# EAGLE schematic E8-F (EAGLE 6.6.0)

## Sheet 1 of 2
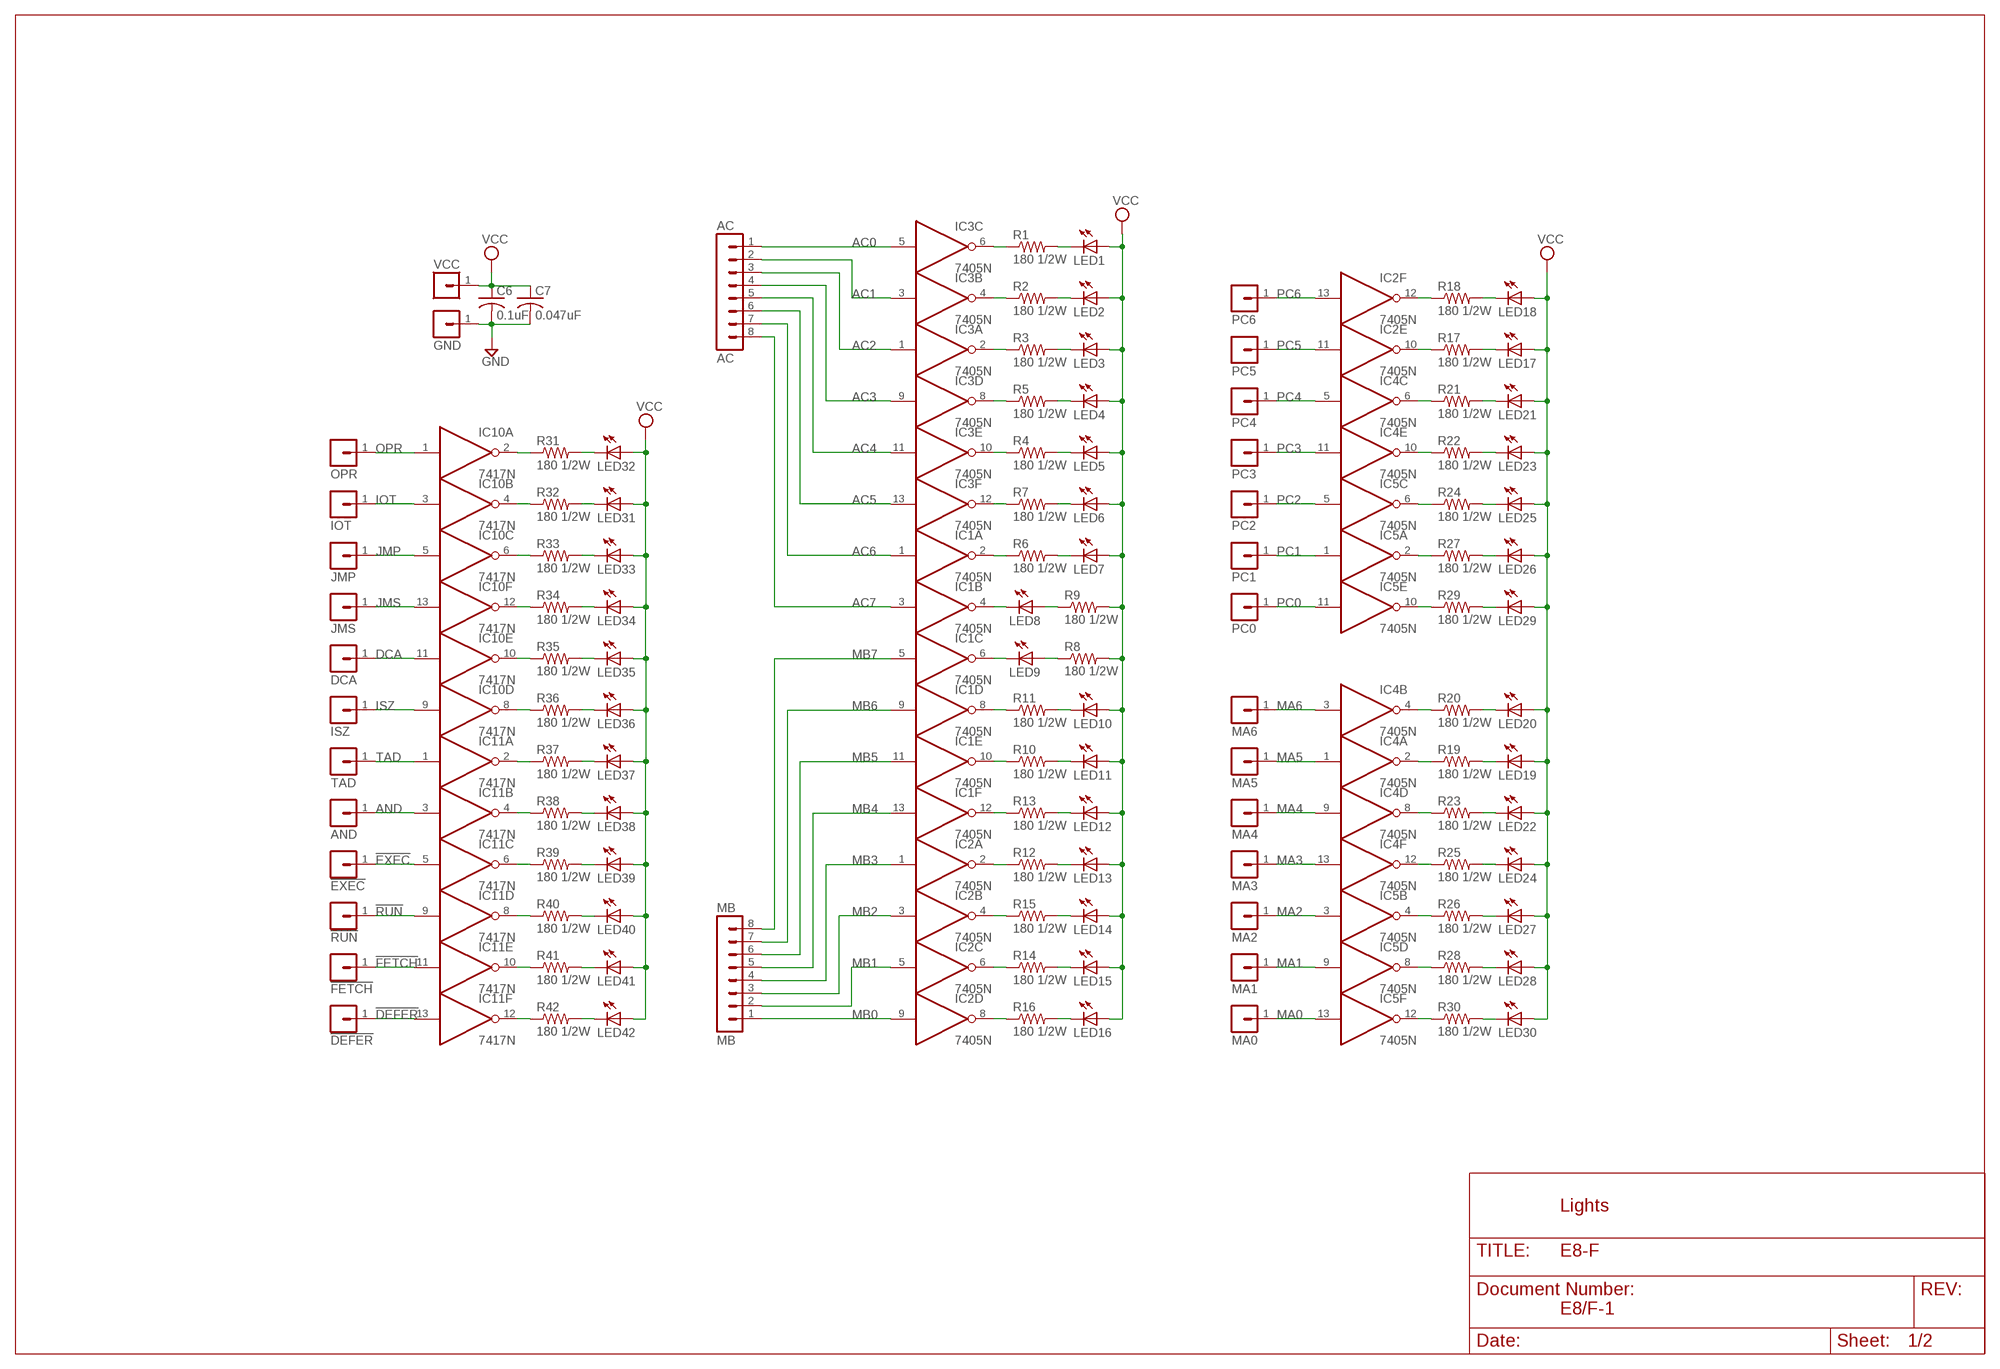
[diagram p0: schematic, sheet 1]

### Parts
!DEFER  MA01-1  [MA01-1]
!EXEC  MA01-1  [MA01-1]
!FETCH  MA01-1  [MA01-1]
!RUN  MA01-1  [MA01-1]
AC  AC  MA08-1  [MA08-1]
AND  MA01-1  [MA01-1]
C6  0.1uF  C-US075-032X103  [C075-032X103]
C7  0.047uF  C-US075-032X103  [C075-032X103]
DCA  MA01-1  [MA01-1]
GND  MA01-1  [MA01-1]
IC1  7405N  [DIL14]
IC2  7405N  [DIL14]
IC3  7405N  [DIL14]
IC4  7405N  [DIL14]
IC5  7405N  [DIL14]
IC10  7417N  [DIL14]
IC11  7417N  [DIL14]
IOT  MA01-1  [MA01-1]
ISZ  MA01-1  [MA01-1]
JMP  MA01-1  [MA01-1]
JMS  MA01-1  [MA01-1]
LED1  LED5MM  [LED5MM]
LED2  LED5MM  [LED5MM]
LED3  LED5MM  [LED5MM]
LED4  LED5MM  [LED5MM]
LED5  LED5MM  [LED5MM]
LED6  LED5MM  [LED5MM]
LED7  LED5MM  [LED5MM]
LED8  LED5MM  [LED5MM]
LED9  LED5MM  [LED5MM]
LED10  LED5MM  [LED5MM]
LED11  LED5MM  [LED5MM]
LED12  LED5MM  [LED5MM]
LED13  LED5MM  [LED5MM]
LED14  LED5MM  [LED5MM]
LED15  LED5MM  [LED5MM]
LED16  LED5MM  [LED5MM]
LED17  LED5MM  [LED5MM]
LED18  LED5MM  [LED5MM]
LED19  LED5MM  [LED5MM]
LED20  LED5MM  [LED5MM]
LED21  LED5MM  [LED5MM]
LED22  LED5MM  [LED5MM]
LED23  LED5MM  [LED5MM]
LED24  LED5MM  [LED5MM]
LED25  LED5MM  [LED5MM]
LED26  LED5MM  [LED5MM]
LED27  LED5MM  [LED5MM]
LED28  LED5MM  [LED5MM]
LED29  LED5MM  [LED5MM]
LED30  LED5MM  [LED5MM]
LED31  LED5MM  [LED5MM]
LED32  LED5MM  [LED5MM]
LED33  LED5MM  [LED5MM]
LED34  LED5MM  [LED5MM]
LED35  LED5MM  [LED5MM]
LED36  LED5MM  [LED5MM]
LED37  LED5MM  [LED5MM]
LED38  LED5MM  [LED5MM]
LED39  LED5MM  [LED5MM]
LED40  LED5MM  [LED5MM]
LED41  LED5MM  [LED5MM]
LED42  LED5MM  [LED5MM]
MA0  MA01-1  [MA01-1]
MA1  MA01-1  [MA01-1]
MA2  MA01-1  [MA01-1]
MA3  MA01-1  [MA01-1]
MA4  MA01-1  [MA01-1]
MA5  MA01-1  [MA01-1]
MA6  MA01-1  [MA01-1]
MB  MB  MA08-1  [MA08-1]
OPR  MA01-1  [MA01-1]
PC0  MA01-1  [MA01-1]
PC1  MA01-1  [MA01-1]
PC2  MA01-1  [MA01-1]
PC3  MA01-1  [MA01-1]
PC4  MA01-1  [MA01-1]
PC5  MA01-1  [MA01-1]
PC6  MA01-1  [MA01-1]
R1  180 1/2W  R-US_0309/.45  [0309/.45]
R2  180 1/2W  R-US_0309/.45  [0309/.45]
R3  180 1/2W  R-US_0309/.45  [0309/.45]
R4  180 1/2W  R-US_0309/12  [0309/12]
R5  180 1/2W  R-US_0309/.45  [0309/.45]
R6  180 1/2W  R-US_0309/12  [0309/12]
R7  180 1/2W  R-US_0309/.45  [0309/.45]
R8  180 1/2W  R-US_0309/12  [0309/12]
R9  180 1/2W  R-US_0309/12  [0309/12]
R10  180 1/2W  R-US_0309/.45  [0309/.45]
R11  180 1/2W  R-US_0309/11  [0309/11]
R12  180 1/2W  R-US_0309/12  [0309/12]
R13  180 1/2W  R-US_0309/.45  [0309/.45]
R14  180 1/2W  R-US_0309/.45  [0309/.45]
R15  180 1/2W  R-US_0309/12  [0309/12]
R16  180 1/2W  R-US_0309/12  [0309/12]
R17  180 1/2W  R-US_0309/12  [0309/12]
R18  180 1/2W  R-US_0309/12  [0309/12]
R19  180 1/2W  R-US_0309/12  [0309/12]
R20  180 1/2W  R-US_0309/15  [0309/15]
R21  180 1/2W  R-US_0309/.45  [0309/.45]
R22  180 1/2W  R-US_0309/10  [0309/10]
R23  180 1/2W  R-US_0309/10  [0309/10]
R24  180 1/2W  R-US_0309/12  [0309/12]
R25  180 1/2W  R-US_0309/10  [0309/10]
R26  180 1/2W  R-US_0309/10  [0309/10]
R27  180 1/2W  R-US_0309/15  [0309/15]
R28  180 1/2W  R-US_0309/.45  [0309/.45]
R29  180 1/2W  R-US_0309/.45  [0309/.45]
R30  180 1/2W  R-US_0309/.45  [0309/.45]
R31  180 1/2W  R-US_0309/8  [0309/8]
R32  180 1/2W  R-US_0309/8  [0309/8]
R33  180 1/2W  R-US_0309/8  [0309/8]
R34  180 1/2W  R-US_0309/8  [0309/8]
R35  180 1/2W  R-US_0309/8  [0309/8]
R36  180 1/2W  R-US_0309/8  [0309/8]
R37  180 1/2W  R-US_0309/8  [0309/8]
R38  180 1/2W  R-US_0309/8  [0309/8]
R39  180 1/2W  R-US_0309/10  [0309/10]
R40  180 1/2W  R-US_0309/10  [0309/10]
R41  180 1/2W  R-US_0309/10  [0309/10]
R42  180 1/2W  R-US_0309/10  [0309/10]
TAD  MA01-1  [MA01-1]
VCC  MA01-1  [MA01-1]

### Nets
!DEFER: !DEFER.1 IC11.13(F:I)
!EXEC: !EXEC.1 IC11.5(C:I)
!FETCH: !FETCH.1 IC11.11(E:I)
!RUN: !RUN.1 IC11.9(D:I)
AC0: AC.1 IC3.5(C:I)
AC1: AC.2 IC3.3(B:I)
AC2: AC.3 IC3.1(A:I)
AC3: AC.4 IC3.9(D:I)
AC4: AC.5 IC3.11(E:I)
AC5: AC.6 IC3.13(F:I)
AC6: AC.7 IC1.1(A:I)
AC7: AC.8 IC1.3(B:I)
AND: AND.1 IC11.3(B:I)
DCA: DCA.1 IC10.11(E:I)
GND: C6.2 C7.2 GND.1 ; also sheet 2
IOT: IC10.3(B:I) IOT.1
ISZ: IC10.9(D:I) ISZ.1
JMP: IC10.5(C:I) JMP.1
JMS: IC10.13(F:I) JMS.1
MA0: IC5.13(F:I) MA0.1
MA1: IC5.9(D:I) MA1.1
MA2: IC5.3(B:I) MA2.1
MA3: IC4.13(F:I) MA3.1
MA4: IC4.9(D:I) MA4.1
MA5: IC4.1(A:I) MA5.1
MA6: IC4.3(B:I) MA6.1
MB0: IC2.9(D:I) MB.1
MB1: IC2.5(C:I) MB.2
MB2: IC2.3(B:I) MB.3
MB3: IC2.1(A:I) MB.4
MB4: IC1.13(F:I) MB.5
MB5: IC1.11(E:I) MB.6
MB6: IC1.9(D:I) MB.7
MB7: IC1.5(C:I) MB.8
N$1: IC2.12(F:O) R18.1
N$2: IC2.10(E:O) R17.1
N$3: IC3.6(C:O) R1.1
N$4: IC3.4(B:O) R2.1
N$5: IC3.2(A:O) R3.1
N$6: IC3.12(F:O) R7.1
N$7: LED7.K(C) R6.2
N$8: LED12.K(C) R13.2
N$9: IC1.10(E:O) R10.1
N$10: LED10.K(C) R11.2
N$11: IC1.6(C:O) LED9.K(C)
N$12: LED8.A R9.1
N$13: IC1.2(A:O) R6.1
N$14: LED9.A R8.1
N$15: IC1.4(B:O) LED8.K(C)
N$16: IC1.8(D:O) R11.1
N$17: LED11.K(C) R10.2
N$18: IC2.8(D:O) R16.1
N$19: LED13.K(C) R12.2
N$20: LED18.K(C) R18.2
N$21: LED17.K(C) R17.2
N$22: LED16.K(C) R16.2
N$23: LED15.K(C) R14.2
N$24: LED14.K(C) R15.2
N$25: IC2.6(C:O) R14.1
N$26: IC2.4(B:O) R15.1
N$27: IC2.2(A:O) R12.1
N$28: IC1.12(F:O) R13.1
N$29: IC3.10(E:O) R4.1
N$30: IC3.8(D:O) R5.1
N$31: LED1.K(C) R1.2
N$32: LED6.K(C) R7.2
N$33: LED5.K(C) R4.2
N$34: LED4.K(C) R5.2
N$35: LED3.K(C) R3.2
N$36: LED2.K(C) R2.2
N$37: LED25.K(C) R24.2
N$38: LED19.K(C) R19.2
N$39: LED24.K(C) R25.2
N$40: LED23.K(C) R22.2
N$41: LED22.K(C) R23.2
N$42: LED21.K(C) R21.2
N$43: IC5.6(C:O) R24.1
N$44: LED26.K(C) R27.2
N$45: LED27.K(C) R26.2
N$46: LED28.K(C) R28.2
N$47: LED29.K(C) R29.2
N$48: LED30.K(C) R30.2
N$49: LED31.K(C) R32.2
N$50: LED32.K(C) R31.2
N$51: LED33.K(C) R33.2
N$52: LED34.K(C) R34.2
N$53: LED35.K(C) R35.2
N$54: LED36.K(C) R36.2
N$55: IC5.2(A:O) R27.1
N$56: IC5.12(F:O) R30.1
N$57: IC5.10(E:O) R29.1
N$58: IC5.8(D:O) R28.1
N$59: LED37.K(C) R37.2
N$60: IC5.4(B:O) R26.1
N$109: LED40.K(C) R40.2
N$110: LED39.K(C) R39.2
N$111: LED38.K(C) R38.2
N$112: LED42.K(C) R42.2
N$113: LED41.K(C) R41.2
N$115: IC10.2(A:O) R31.1
N$116: IC10.8(D:O) R36.1
N$117: IC10.10(E:O) R35.1
N$118: IC10.12(F:O) R34.1
N$119: IC10.6(C:O) R33.1
N$120: IC10.4(B:O) R32.1
N$127: IC11.2(A:O) R37.1
N$128: IC11.12(F:O) R42.1
N$129: IC11.10(E:O) R41.1
N$130: IC11.8(D:O) R40.1
N$131: IC11.6(C:O) R39.1
N$132: IC11.4(B:O) R38.1
N$134: LED20.K(C) R20.2
N$135: IC4.2(A:O) R19.1
N$136: IC4.4(B:O) R20.1
N$137: IC4.6(C:O) R21.1
N$138: IC4.12(F:O) R25.1
N$140: IC4.10(E:O) R22.1
N$141: IC4.8(D:O) R23.1
OPR: IC10.1(A:I) OPR.1
PC0: IC5.11(E:I) PC0.1
PC1: IC5.1(A:I) PC1.1
PC2: IC5.5(C:I) PC2.1
PC3: IC4.11(E:I) PC3.1
PC4: IC4.5(C:I) PC4.1
PC5: IC2.11(E:I) PC5.1
PC6: IC2.13(F:I) PC6.1
TAD: IC11.1(A:I) TAD.1
VCC: C6.1 C7.1 LED1.A LED2.A LED3.A LED4.A LED5.A LED6.A LED7.A LED10.A LED11.A LED12.A LED13.A LED14.A LED15.A LED16.A LED17.A LED18.A LED19.A LED20.A LED21.A LED22.A LED23.A LED24.A LED25.A LED26.A LED27.A LED28.A LED29.A LED30.A LED31.A LED32.A LED33.A LED34.A LED35.A LED36.A LED37.A LED38.A LED39.A LED40.A LED41.A LED42.A R8.2 R9.2 VCC.1 ; also sheet 2

### Notes on the sheet
- Lights
- E8/F-1

## Sheet 2 of 2
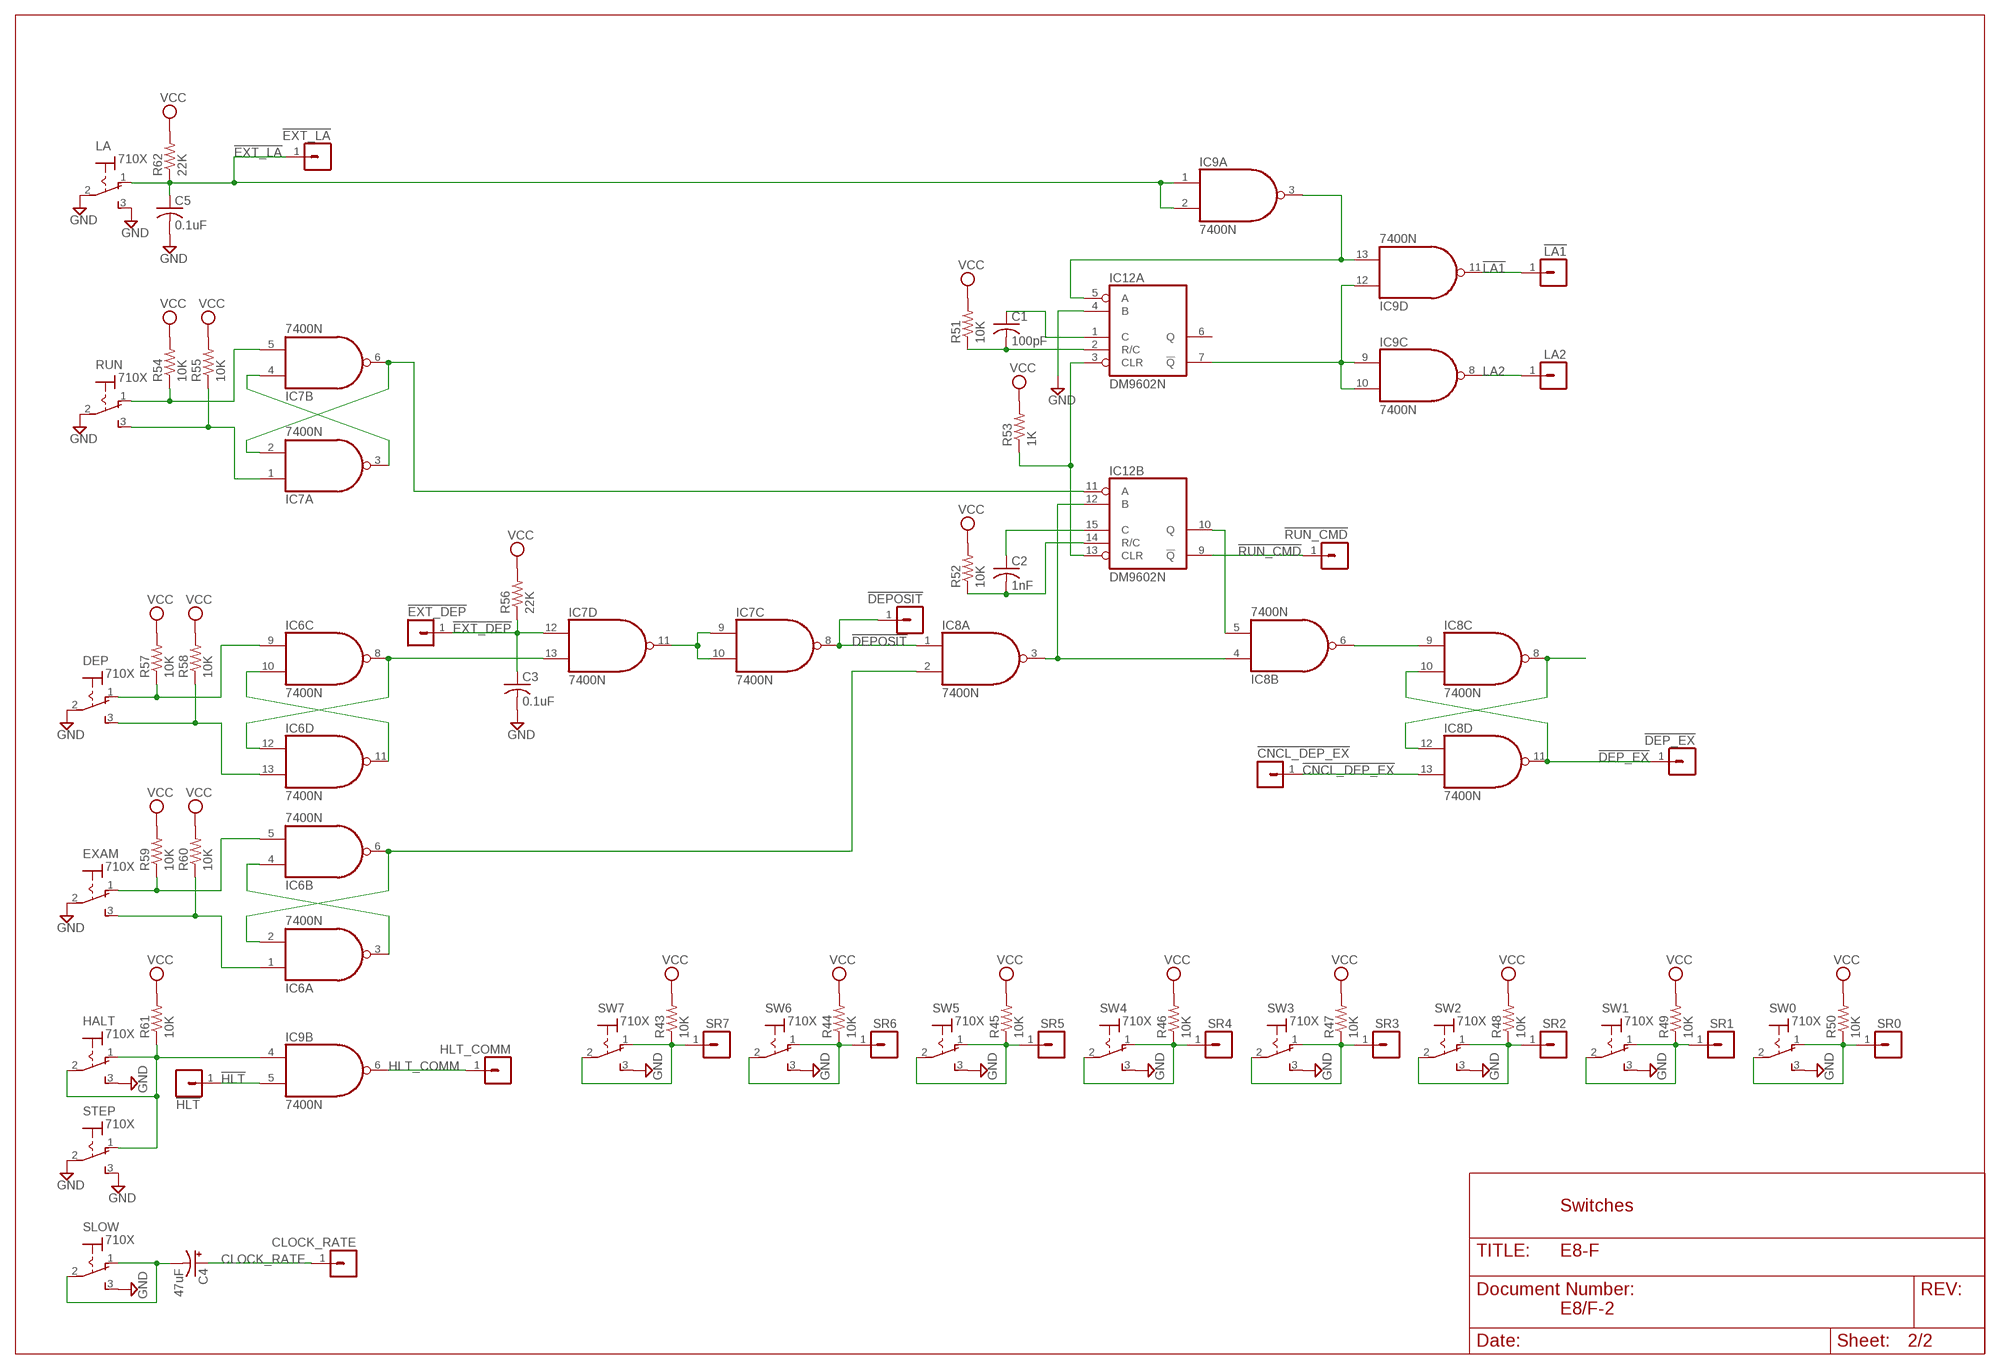
[diagram p1: schematic, sheet 2]

### Parts
!CNCL_DEP_EX  MA01-1  [MA01-1]
!DEP_EX  MA01-1  [MA01-1]
!DEPOSIT  MA01-1  [MA01-1]
!EXT_DEP  MA01-1  [MA01-1]
!EXT_LA  MA01-1  [MA01-1]
!HLT  MA01-1  [MA01-1]
!LA1  MA01-1  [MA01-1]
!RUN_CMD  MA01-1  [MA01-1]
C1  100pF  C-US075-032X103  [C075-032X103]
C2  1nF  C-US075-032X103  [C075-032X103]
C3  0.1uF  C-US  [C063-025X075]
C4  47uF  CPOL-USB45181C  [B45181C]
C5  0.1uF  C-US075-032X103  [C075-032X103]
CLOCK_RATE  MA01-1  [MA01-1]
DEP  710X  [7109]
EXAM  710X  [7109]
HALT  710X  [7109]
HLT_COMM  MA01-1  [MA01-1]
IC6  7400N  [DIL14]
IC7  7400N  [DIL14]
IC8  7400N  [DIL14]
IC9  7400N  [DIL14]
IC12  DM9602N  [DIL16]
LA  710X  [7109]
LA2  MA01-1  [MA01-1]
R43  10K  R-US_0207/12  [0207/12]
R44  10K  R-US_0207/12  [0207/12]
R45  10K  R-US_0207/12  [0207/12]
R46  10K  R-US_0207/12  [0207/12]
R47  10K  R-US_0207/12  [0207/12]
R48  10K  R-US_0207/12  [0207/12]
R49  10K  R-US_0207/12  [0207/12]
R50  10K  R-US_0207/12  [0207/12]
R51  10K  R-US_0207/10  [0207/10]
R52  10K  R-US_0207/15  [0207/15]
R53  1K  R-US_0204/6  [0204/6]
R54  10K  R-US_0207/13  [0207/13]
R55  10K  R-US_0207/13  [0207/13]
R56  22K  R-US_0207/10  [0207/10]
R57  10K  R-US_0207/13  [0207/13]
R58  10K  R-US_0207/13  [0207/13]
R59  10K  R-US_0207/13  [0207/13]
R60  10K  R-US_0207/13  [0207/13]
R61  10K  R-US_0207/22  [0207/22]
R62  22K  R-US_0207/13  [0207/13]
RUN  710X  [7109]
SLOW  710X  [7109]
SR0  MA01-1  [MA01-1]
SR1  MA01-1  [MA01-1]
SR2  MA01-1  [MA01-1]
SR3  MA01-1  [MA01-1]
SR4  MA01-1  [MA01-1]
SR5  MA01-1  [MA01-1]
SR6  MA01-1  [MA01-1]
SR7  MA01-1  [MA01-1]
STEP  710X  [7109]
SW0  710X  [7109]
SW1  710X  [7109]
SW2  710X  [7109]
SW3  710X  [7109]
SW4  710X  [7109]
SW5  710X  [7109]
SW6  710X  [7109]
SW7  710X  [7109]

### Nets
!CNCL_DEP_EX: !CNCL_DEP_EX.1 IC8.13(D:I1)
!DEP_EX: !DEP_EX.1 IC8.10(C:I1) IC8.11(D:O)
!DEPOSIT: !DEPOSIT.1 IC7.8(C:O) IC8.1(A:I0)
!EXT_DEP: !EXT_DEP.1 C3.1 IC7.12(D:I0) R56.1
!EXT_LA: !EXT_LA.1 C5.1 IC9.1(A:I0) IC9.2(A:I1) LA.1(O) R62.1
!HLT: !HLT.1 IC9.5(B:I1)
!LA1: !LA1.1 IC9.11(D:O)
!RUN_CMD: !RUN_CMD.1 IC12.9(B:!Q)
CLOCK_RATE: C4.+ CLOCK_RATE.1
GND: C3.2 C5.2 DEP.2(P) EXAM.2(P) HALT.3(S) IC12.4(A:B) LA.2(P) LA.3(S) RUN.2(P) SLOW.3(S) STEP.2(P) STEP.3(S) SW0.3(S) SW1.3(S) SW2.3(S) SW3.3(S) SW4.3(S) SW5.3(S) SW6.3(S) SW7.3(S) ; also sheet 1
HALT: HALT.1(O) HALT.2(P) IC9.4(B:I0) R61.1 STEP.1(O)
HLT_COMM: HLT_COMM.1 IC9.6(B:O)
LA2: IC9.8(C:O) LA2.1
N$61: DEP.3(S) IC6.13(D:I1) R58.1
N$62: IC6.3(A:O) IC6.4(B:I0)
N$63: EXAM.1(O) IC6.5(B:I1) R59.1
N$64: IC6.2(A:I1) IC6.6(B:O) IC8.2(A:I1)
N$65: EXAM.3(S) IC6.1(A:I0) R60.1
N$66: IC8.6(B:O) IC8.9(C:I0)
N$67: DEP.1(O) IC6.9(C:I0) R57.1
N$68: IC6.10(C:I1) IC6.11(D:O)
N$69: IC6.8(C:O) IC6.12(D:I0) IC7.13(D:I1)
N$75: IC7.1(A:I0) R55.1 RUN.3(S)
N$76: IC7.2(A:I1) IC7.6(B:O) IC12.11(B:A)
N$77: IC7.3(A:O) IC7.4(B:I0)
N$78: IC7.5(B:I1) R54.1 RUN.1(O)
N$79: IC7.9(C:I0) IC7.10(C:I1) IC7.11(D:O)
N$86: IC8.3(A:O) IC8.4(B:I0) IC12.12(B:B)
N$90: IC8.5(B:I1) IC12.10(B:Q)
N$93: IC8.8(C:O) IC8.12(D:I0)
N$97: IC9.3(A:O) IC9.13(D:I1) IC12.5(A:A)
N$98: C2.2 IC12.14(B:R/C) R52.1
N$100: C1.2 IC12.2(A:R/C) R51.1
N$103: IC9.9(C:I0) IC9.10(C:I1) IC9.12(D:I0) IC12.7(A:!Q)
N$104: C1.1 IC12.1(A:C)
N$105: C2.1 IC12.15(B:C)
N$139: IC12.3(A:CLR) IC12.13(B:CLR) R53.1
SLOW: C4.- SLOW.1(O) SLOW.2(P)
SR0: R50.1 SR0.1 SW0.1(O) SW0.2(P)
SR1: R49.1 SR1.1 SW1.1(O) SW1.2(P)
SR2: R48.1 SR2.1 SW2.1(O) SW2.2(P)
SR3: R47.1 SR3.1 SW3.1(O) SW3.2(P)
SR4: R46.1 SR4.1 SW4.1(O) SW4.2(P)
SR5: R45.1 SR5.1 SW5.1(O) SW5.2(P)
SR6: R44.1 SR6.1 SW6.1(O) SW6.2(P)
SR7: R43.1 SR7.1 SW7.1(O) SW7.2(P)
VCC: R43.2 R44.2 R45.2 R46.2 R47.2 R48.2 R49.2 R50.2 R51.2 R52.2 R53.2 R54.2 R55.2 R56.2 R57.2 R58.2 R59.2 R60.2 R61.2 R62.2 ; also sheet 1
Unconnected: IC12.6(A:Q)

### Notes on the sheet
- Switches
- E8/F-2

## Power pins joined to a net without a drawn wire
GND: IC1.7(P:GND) IC2.7(P:GND) IC3.7(P:GND) IC4.7(P:GND) IC5.7(P:GND) IC6.7(P:GND) IC7.7(P:GND) IC8.7(P:GND) IC9.7(P:GND) IC10.7(P:GND) IC11.7(P:GND) IC12.8(P:GND)
VCC: IC1.14(P:VCC) IC2.14(P:VCC) IC3.14(P:VCC) IC4.14(P:VCC) IC5.14(P:VCC) IC6.14(P:VCC) IC7.14(P:VCC) IC8.14(P:VCC) IC9.14(P:VCC) IC10.14(P:VCC) IC11.14(P:VCC) IC12.16(P:VCC)

## Library data of the parts
!CNCL_DEP_EX !DEFER !DEP_EX !DEPOSIT !EXEC !EXT_DEP !EXT_LA !FETCH !HLT !LA1 !RUN !RUN_CMD AND CLOCK_RATE DCA GND HLT_COMM IOT ISZ JMP JMS LA2 MA0 MA1-MA6 OPR PC0 PC1-PC6 SR0 SR1-SR7 TAD VCC = dec-con:MA01-1: Pin Header (.125" spacing)
AC MB = dec-con:MA08-1: Pin Header (.125" spacing)
C1 C2 C5-C7 = rcl:C-US: CAPACITOR, American symbol
C3 = dec-con:C-US: Capacitors with funky DEC lead spacing.
C4 = rcl:CPOL-US: POLARIZED CAPACITOR, American symbol
DEP EXAM HALT LA RUN SLOW STEP SW0 SW1-SW7 = Educ-8:710X: 710x without optional mounting bracket.
IC1-IC5 = 74xx-us:74*05: Hex INVERTER, open collector
IC6-IC9 = 74xx-us:74*00: Quad 2-input NAND gate
IC10 IC11 = 74xx-us:74*17: Hex INVERTER, open collector, high-voltage
IC12 = Educ-8:DM9602: Retriggerable monostable MULTIVIBRATOR
LED1-LED42 = led:LED: LED OSRAM: - CHIPLED LG R971, LG N971, LY N971, LG Q971, LY Q971, LO R971, LY R971 LH N974, LH R974 LS Q976, LO Q976, LY Q976 LO Q996 - Hyper CHIPLED LW Q18S LB Q993, LB Q99A, LB R99A - SideLED LS A670, LO A670, LY A670, LG A670, LP A670 LB A673, LV A673, LT A673, LW A673 LH A674 LY A675 LS A676, LA A676, LO A676, LY A676, LW A676 LS A679, LY A679, LG A679 - Hyper Micro SIDELED® LS Y876, LA Y876, LO Y876, LY Y876 LT Y87S - SmartLED LW L88C, LW L88S LB L89C, LB L89S, LG L890 LS L89K, LO L89K, LY L89K LS L896, LA L896, LO L896, LY L896 - TOPLED LS T670, LO T670, LY T670, LG T670, LP T670 LSG T670, LSP T670, LSY T670, LOP T670, LYG T670 LG T671, LOG T671, LSG T671 LB T673, LV T673, LT T673, LW T673 LH T674 LS T676, LA T676, LO T676, LY T676, LB T676, LH T676, LSB T676, LW T676 LB T67C, LV T67C, LT T67C, LS T67K, LO T67K, LY T67K, LW E67C LS E67B, LA E67B, LO E67B, LY E67B, LB E67C, LV E67C, LT E67C LW T67C LS T679, LY T679, LG T679 LS T770, LO T770, LY T770, LG T770, LP T770 LB T773, LV T773, LT T773, LW T773 LH T774 LS E675, LA E675, LY E675, LS T675 LS T776, LA T776, LO T776, LY T776, LB T776 LHGB T686 LT T68C, LB T68C - Hyper Mini TOPLED® LB M676 - Mini TOPLED Santana® LG M470 LS M47K, LO M47K, LY M47K Source: http://www.osram.convergy.de LUXEON: - LUMILED® LXK2-PW12-R00, LXK2-PW12-S00, LXK2-PW14-U00, LXK2-PW14-V00 LXK2-PM12-R00, LXK2-PM12-S00, LXK2-PM14-U00 LXK2-PE12-Q00, LXK2-PE12-R00, LXK2-PE12-S00, LXK2-PE14-T00, LXK2-PE14-U00 LXK2-PB12-K00, LXK2-PB12-L00, LXK2-PB12-M00, LXK2-PB14-N00, LXK2-PB14-P00, LXK2-PB14-Q00 LXK2-PR12-L00, LXK2-PR12-M00, LXK2-PR14-Q00, LXK2-PR14-R00 LXK2-PD12-Q00, LXK2-PD12-R00, LXK2-PD12-S00 LXK2-PH12-R00, LXK2-PH12-S00 LXK2-PL12-P00, LXK2-PL12-Q00, LXK2-PL12-R00 Source: www.luxeon.com KINGBRIGHT: KA-3528ASYC Source: www.kingbright.com
R1-R3 R5 R7 R10 R11 R13 R14 R19-R22 R26-R42 R53-R62 = Educ-8:R-US_: RESISTOR, American symbol
R4 R6 R8 R9 R12 R15-R18 R23-R25 R43-R52 = rcl:R-US_: RESISTOR, American symbol